# EAGLE design Amplificador_Ganho_1000_Versão4 (EAGLE 4.09)
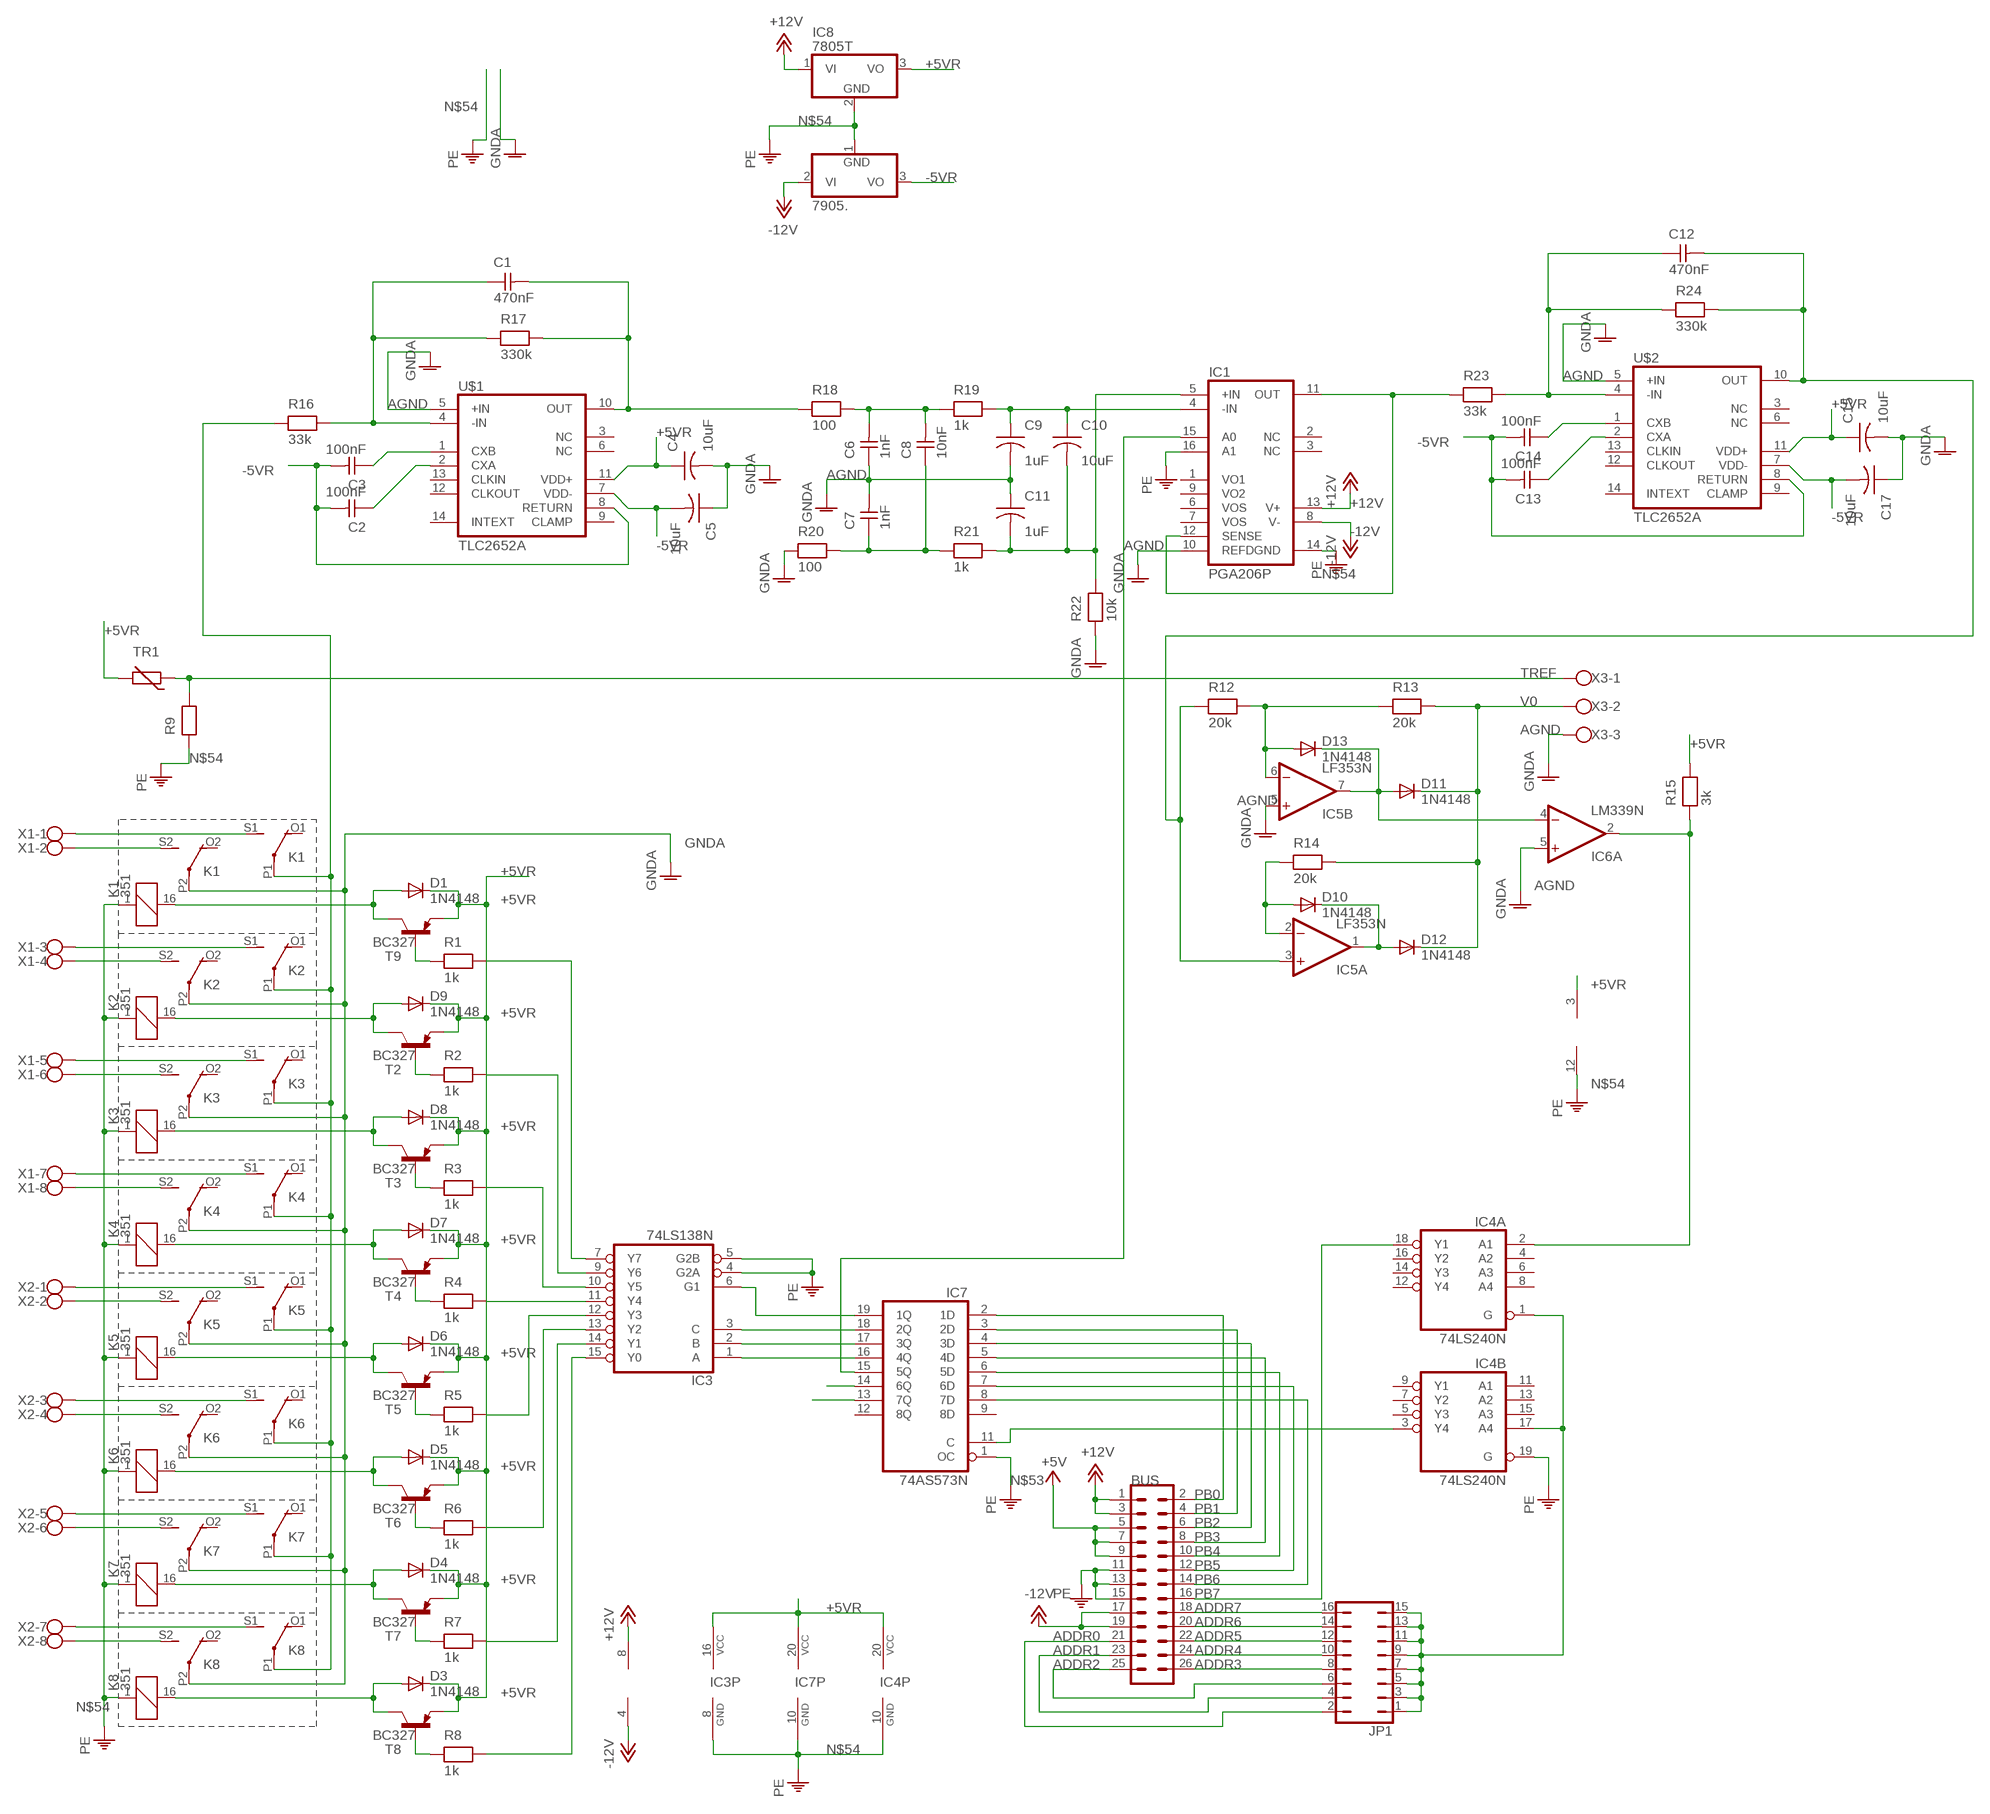
[diagram p0: schematic, sheet 1]

## Parts
7905.  7905T  [TO220H]
BUS  ML26  [ML26]
C1  470nF  CAPNP-5  [C-5]
C2  100nF  CAPNP-5  [C-5]
C3  100nF  CAPNP-5  [C-5]
C4  10uF  CAP-2,5  [C-2,5]
C5  10uF  CAP-2,5  [C-2,5]
C6  1nF  CAPNP-5  [C-5]
C7  1nF  CAPNP-5  [C-5]
C8  10nF  CAPNP-5  [C-5]
C9  1uF  CAP-2,5  [C-2,5]
C10  10uF  CAP-2,5  [C-2,5]
C11  1uF  CAP-2,5  [C-2,5]
C12  470nF  CAPNP-5  [C-5]
C13  100nF  CAPNP-5  [C-5]
C14  100nF  CAPNP-5  [C-5]
C15  10uF  CAP-2,5  [C-2,5]
C17  10uF  CAP-2,5  [C-2,5]
D1  1N4148  [DO35-10]
D3  1N4148  [DO35-10]
D4  1N4148  [DO35-10]
D5  1N4148  [DO35-10]
D6  1N4148  [DO35-10]
D7  1N4148  [DO35-10]
D8  1N4148  [DO35-10]
D9  1N4148  [DO35-10]
D10  1N4148  [DO35-10]
D11  1N4148  [DO35-10]
D12  1N4148  [DO35-10]
D13  1N4148  [DO35-10]
IC1  PGA206P  [DIL16]
IC3  74LS138N  [DIL16]
IC4  74LS240N  [DIL20]
IC5  LF353N  [DIL08]
IC6  LM339N  [DIL14]
IC7  74AS573N  [DIL20]
IC8  7805T  [TO220H]
JP1  JP8Q  [JP8Q]
K1  351  [351]
K2  351  [351]
K3  351  [351]
K4  351  [351]
K5  351  [351]
K6  351  [351]
K7  351  [351]
K8  351  [351]
R1  1k  RESEU-10  [R-10]
R2  1k  RESEU-10  [R-10]
R3  1k  RESEU-10  [R-10]
R4  1k  RESEU-10  [R-10]
R5  1k  RESEU-10  [R-10]
R6  1k  RESEU-10  [R-10]
R7  1k  RESEU-10  [R-10]
R8  1k  RESEU-10  [R-10]
R9  RESEU-10  [R-10]
R12  20k  RESEU-10  [R-10]
R13  20k  RESEU-10  [R-10]
R14  20k  RESEU-10  [R-10]
R15  3k  RESEU-10  [R-10]
R16  33k  RESEU-10  [R-10]
R17  330k  RESEU-10  [R-10]
R18  100  RESEU-10  [R-10]
R19  1k  RESEU-10  [R-10]
R20  100  RESEU-10  [R-10]
R21  1k  RESEU-10  [R-10]
R22  10k  RESEU-10  [R-10]
R23  33k  RESEU-10  [R-10]
R24  330k  RESEU-10  [R-10]
T2  BC327  [TO92]
T3  BC327  [TO92]
T4  BC327  [TO92]
T5  BC327  [TO92]
T6  BC327  [TO92]
T7  BC327  [TO92]
T8  BC327  [TO92]
T9  BC327  [TO92]
TR1  THERM-2,5  [RS-2,5]
U$1  TLC2652A  [DIP14]
U$2  TLC2652A  [DIP14]
X1  AK500/8  [AK500/8]
X2  AK500/8  [AK500/8]
X3  AK500/3  [AK500/3]

## Nets
+5V: BUS.5 BUS.7 BUS.9
+5VR: C4.1 C15.1 D1.C D3.C D4.C D5.C D6.C D7.C D8.C D9.C IC3.16(VCC) IC4.20(P:VCC) IC6.3(P:V+) IC7.20(VCC) IC8.3(VO) R15.2 T2.1(E) T3.1(E) T4.1(E) T5.1(E) T6.1(E) T7.1(E) T8.1(E) T9.1(E) TR1.2 U$1.11(VDD+) U$2.11(VDD+)
+12V: BUS.1 BUS.3 IC1.13(V+) IC5.8(P:V+) IC8.1(VI)
-5VR: 7905..3(VO) C2.2 C3.2 C5.2 C13.2 C14.2 C17.2 U$1.7(VDD-) U$1.8(RETURN) U$2.7(VDD-) U$2.8(RETURN)
-12V: 7905..2(VI) BUS.17 BUS.19 IC1.8(V-) IC5.4(P:V-)
ADDR0: BUS.21 JP1.2
ADDR1: BUS.23 JP1.4
ADDR2: BUS.25 JP1.6
ADDR3: BUS.26 JP1.8
ADDR4: BUS.24 JP1.10
ADDR5: BUS.22 JP1.12
ADDR6: BUS.20 JP1.14
ADDR7: BUS.18 JP1.16
AGND: C4.2 C5.1 C6.1 C7.2 C9.2 C11.1 C15.2 C17.1 IC1.10(REF) IC5.5(B:+IN) IC6.5(A:+IN) R20.1 R22.1 U$1.5(+IN) U$2.5(+IN) X3.3 ; supply symbol labelled GNDA
GNDA: K1.P2(3:P) K2.P2(3:P) K3.P2(3:P) K4.P2(3:P) K5.P2(3:P) K6.P2(3:P) K7.P2(3:P) K8.P2(3:P)
N$1: IC7.14(6Q)
N$2: R5.1 T5.2(B)
N$3: IC3.7(Y7) R1.2
N$4: IC3.9(Y6) R2.2
N$5: IC3.10(Y5) R3.2
N$6: IC3.11(Y4) R4.2
N$7: IC3.15(Y0) R8.2
N$8: IC3.14(Y1) R7.2
N$9: IC3.13(Y2) R6.2
N$10: R1.1 T9.2(B)
N$11: IC3.1(A) IC7.16(4Q)
N$12: IC3.2(B) IC7.17(3Q)
N$13: IC3.3(C) IC7.18(2Q)
N$14: IC3.6(G1) IC7.19(1Q)
N$15: D6.A K5.16 T5.3(C)
N$16: C10.2 C11.2 IC1.5(+IN) R21.2 R22.2
N$17: R2.1 T2.2(B)
N$18: D1.A K1.16 T9.3(C)
N$19: D9.A K2.16 T2.3(C)
N$20: R6.1 T6.2(B)
N$21: R3.1 T3.2(B)
N$22: D8.A K3.16 T3.3(C)
N$23: D5.A K6.16 T6.3(C)
N$24: R4.1 T4.2(B)
N$25: D7.A K4.16 T4.3(C)
N$26: R7.1 T7.2(B)
N$27: D4.A K7.16 T7.3(C)
N$28: R8.1 T8.2(B)
N$29: D3.A K8.16 T8.3(C)
N$30: IC3.12(Y3) R5.2
N$32: IC4.2(A:A1) IC6.2(A:OUT) R15.1
N$33: IC4.1(A:G) IC4.17(B:A4) JP1.1 JP1.3 JP1.5 JP1.7 JP1.9 JP1.11 JP1.13 JP1.15
N$34: IC7.13(7Q)
N$35: K1.S1(2:S) X1.1
N$36: K1.S2(3:S) X1.2
N$37: K2.S1(2:S) X1.3
N$38: K2.S2(3:S) X1.4
N$39: K3.S1(2:S) X1.5
N$40: K3.S2(3:S) X1.6
N$41: K4.S1(2:S) X1.7
N$42: K4.S2(3:S) X1.8
N$43: K5.S1(2:S) X2.1
N$44: K5.S2(3:S) X2.2
N$45: K6.S1(2:S) X2.3
N$46: K6.S2(3:S) X2.4
N$47: K7.S1(2:S) X2.5
N$48: K7.S2(3:S) X2.6
N$49: K8.S1(2:S) X2.7
N$50: K8.S2(3:S) X2.8
N$52: IC1.11(OUT) IC1.12(SENSE) R23.1
N$53: IC4.3(B:Y4) IC7.11(C)
N$54: 7905..1(GND) BUS.11 BUS.13 BUS.15 IC1.14(DGND) IC1.16(A1) IC3.4(G2A) IC3.5(G2B) IC3.8(GND) IC4.10(P:GND) IC4.19(B:G) IC6.12(P:V-) IC7.1(OC) IC7.10(GND) IC8.2(GND) K1.1 K2.1 K3.1 K4.1 K5.1 K6.1 K7.1 K8.1 R9.1 ; supply symbol labelled PE
N$56: D10.A IC5.2(A:-IN) R14.1
N$57: C1.2 R17.2 R18.1 U$1.10(OUT)
N$58: D10.C D12.A IC5.1(A:OUT)
N$59: K1.P1(2:P) K2.P1(2:P) K3.P1(2:P) K4.P1(2:P) K5.P1(2:P) K6.P1(2:P) K7.P1(2:P) K8.P1(2:P) R16.1
N$60: C3.1 U$1.1(CXB)
N$62: C2.1 U$1.2(CXA)
N$63: D13.A IC5.6(B:-IN) R12.2 R13.1
N$64: D11.A D13.C IC5.7(B:OUT) IC6.4(A:-IN)
N$65: C6.2 C8.2 R18.2 R19.1
N$66: C12.2 IC5.3(A:+IN) R12.1 R24.2 U$2.10(OUT)
N$67: C1.1 R16.2 R17.1 U$1.4(-IN)
N$68: IC1.15(A0) IC7.15(5Q)
N$69: C7.1 C8.1 R20.2 R21.1
N$70: C14.1 U$2.1(CXB)
N$71: C9.1 C10.1 IC1.4(-IN) R19.2
N$73: C13.1 U$2.2(CXA)
N$74: C12.1 R23.2 R24.1 U$2.4(-IN)
PB0: BUS.2 IC7.2(1D)
PB1: BUS.4 IC7.3(2D)
PB2: BUS.6 IC7.4(3D)
PB3: BUS.8 IC7.5(4D)
PB4: BUS.10 IC7.6(5D)
PB5: BUS.12 IC7.7(6D)
PB6: BUS.14 IC7.8(7D)
PB7: BUS.16 IC4.18(A:Y1)
TREF: R9.2 TR1.1 X3.1
V0: D11.C D12.C R13.2 R14.2 X3.2
Unconnected: IC1.1(VO1) IC1.2(NC) IC1.3(NC) IC1.6(VOS) IC1.7(VOS) IC1.9(VO2) IC4.4(A:A2) IC4.5(B:Y3) IC4.6(A:A3) IC4.7(B:Y2) IC4.8(A:A4) IC4.9(B:Y1) IC4.11(B:A1) IC4.12(A:Y4) IC4.13(B:A2) IC4.14(A:Y3) IC4.15(B:A3) IC4.16(A:Y2) IC6.1(B:OUT) IC6.6(B:-IN) IC6.7(B:+IN) IC6.8(C:-IN) IC6.9(C:+IN) IC6.10(D:-IN) IC6.11(D:+IN) IC6.13(D:OUT) IC6.14(C:OUT) IC7.9(8D) IC7.12(8Q) K1.O1(2:O) K1.O2(3:O) K2.O1(2:O) K2.O2(3:O) K3.O1(2:O) K3.O2(3:O) K4.O1(2:O) K4.O2(3:O) K5.O1(2:O) K5.O2(3:O) K6.O1(2:O) K6.O2(3:O) K7.O1(2:O) K7.O2(3:O) K8.O1(2:O) K8.O2(3:O) U$1.3(NC) U$1.6(NC) U$1.9(CLAMP) U$1.12(CLKOUT) U$1.13(CLKIN) U$1.14(INTEXT) U$2.3(NC) U$2.6(NC) U$2.9(CLAMP) U$2.12(CLKOUT) U$2.13(CLKIN) U$2.14(INTEXT)

## Library data of the parts
7905. = linear:79*: Negative VOLTAGE REGULATOR
BUS = con-harting-ml:ML26: HARTING
C1-C3 C6-C8 C12-C14 = discrete:CAPNP-5
C4 C5 C9-C11 C15 C17 = discrete:CAP-2,5
D1 D3-D13 = diode:1N4148: DIODE high speed (Philips)
IC1 = burr-brown:PGA206: High-Speed Programmable Gain Instrumentation Amplifier
IC3 = 74xx-us:74*138: 3-line to 8-line DECODER/DEMULTIPLEXER
IC4 = 74xx-us:74*240: Octal BUFFER and LINE DRIVER, 3-state
IC5 = linear:LF353: OP AMP
IC6 = linear:LM339: COMPARATOR
IC7 = 74xx-us:74*573: 8-bit D latch BUS DRIVER
IC8 = linear:78*: Positive VOLTAGE REGULATOR
JP1 = jumper:JP8Q: JUMPER
K1-K8 = relay:351: RELAY 2 x switch, Omron
R1-R9 R12-R24 = discrete:RESEU-10
T2-T9 = transistor-pnp:BC327: PNP Transistor
TR1 = discrete:THERM-2,5
U$1 U$2 = ti:TLC2652A
X1 X2 = con-ptr500:AK500/8: CONNECTOR
X3 = con-ptr500:AK500/3: CONNECTOR

## Board
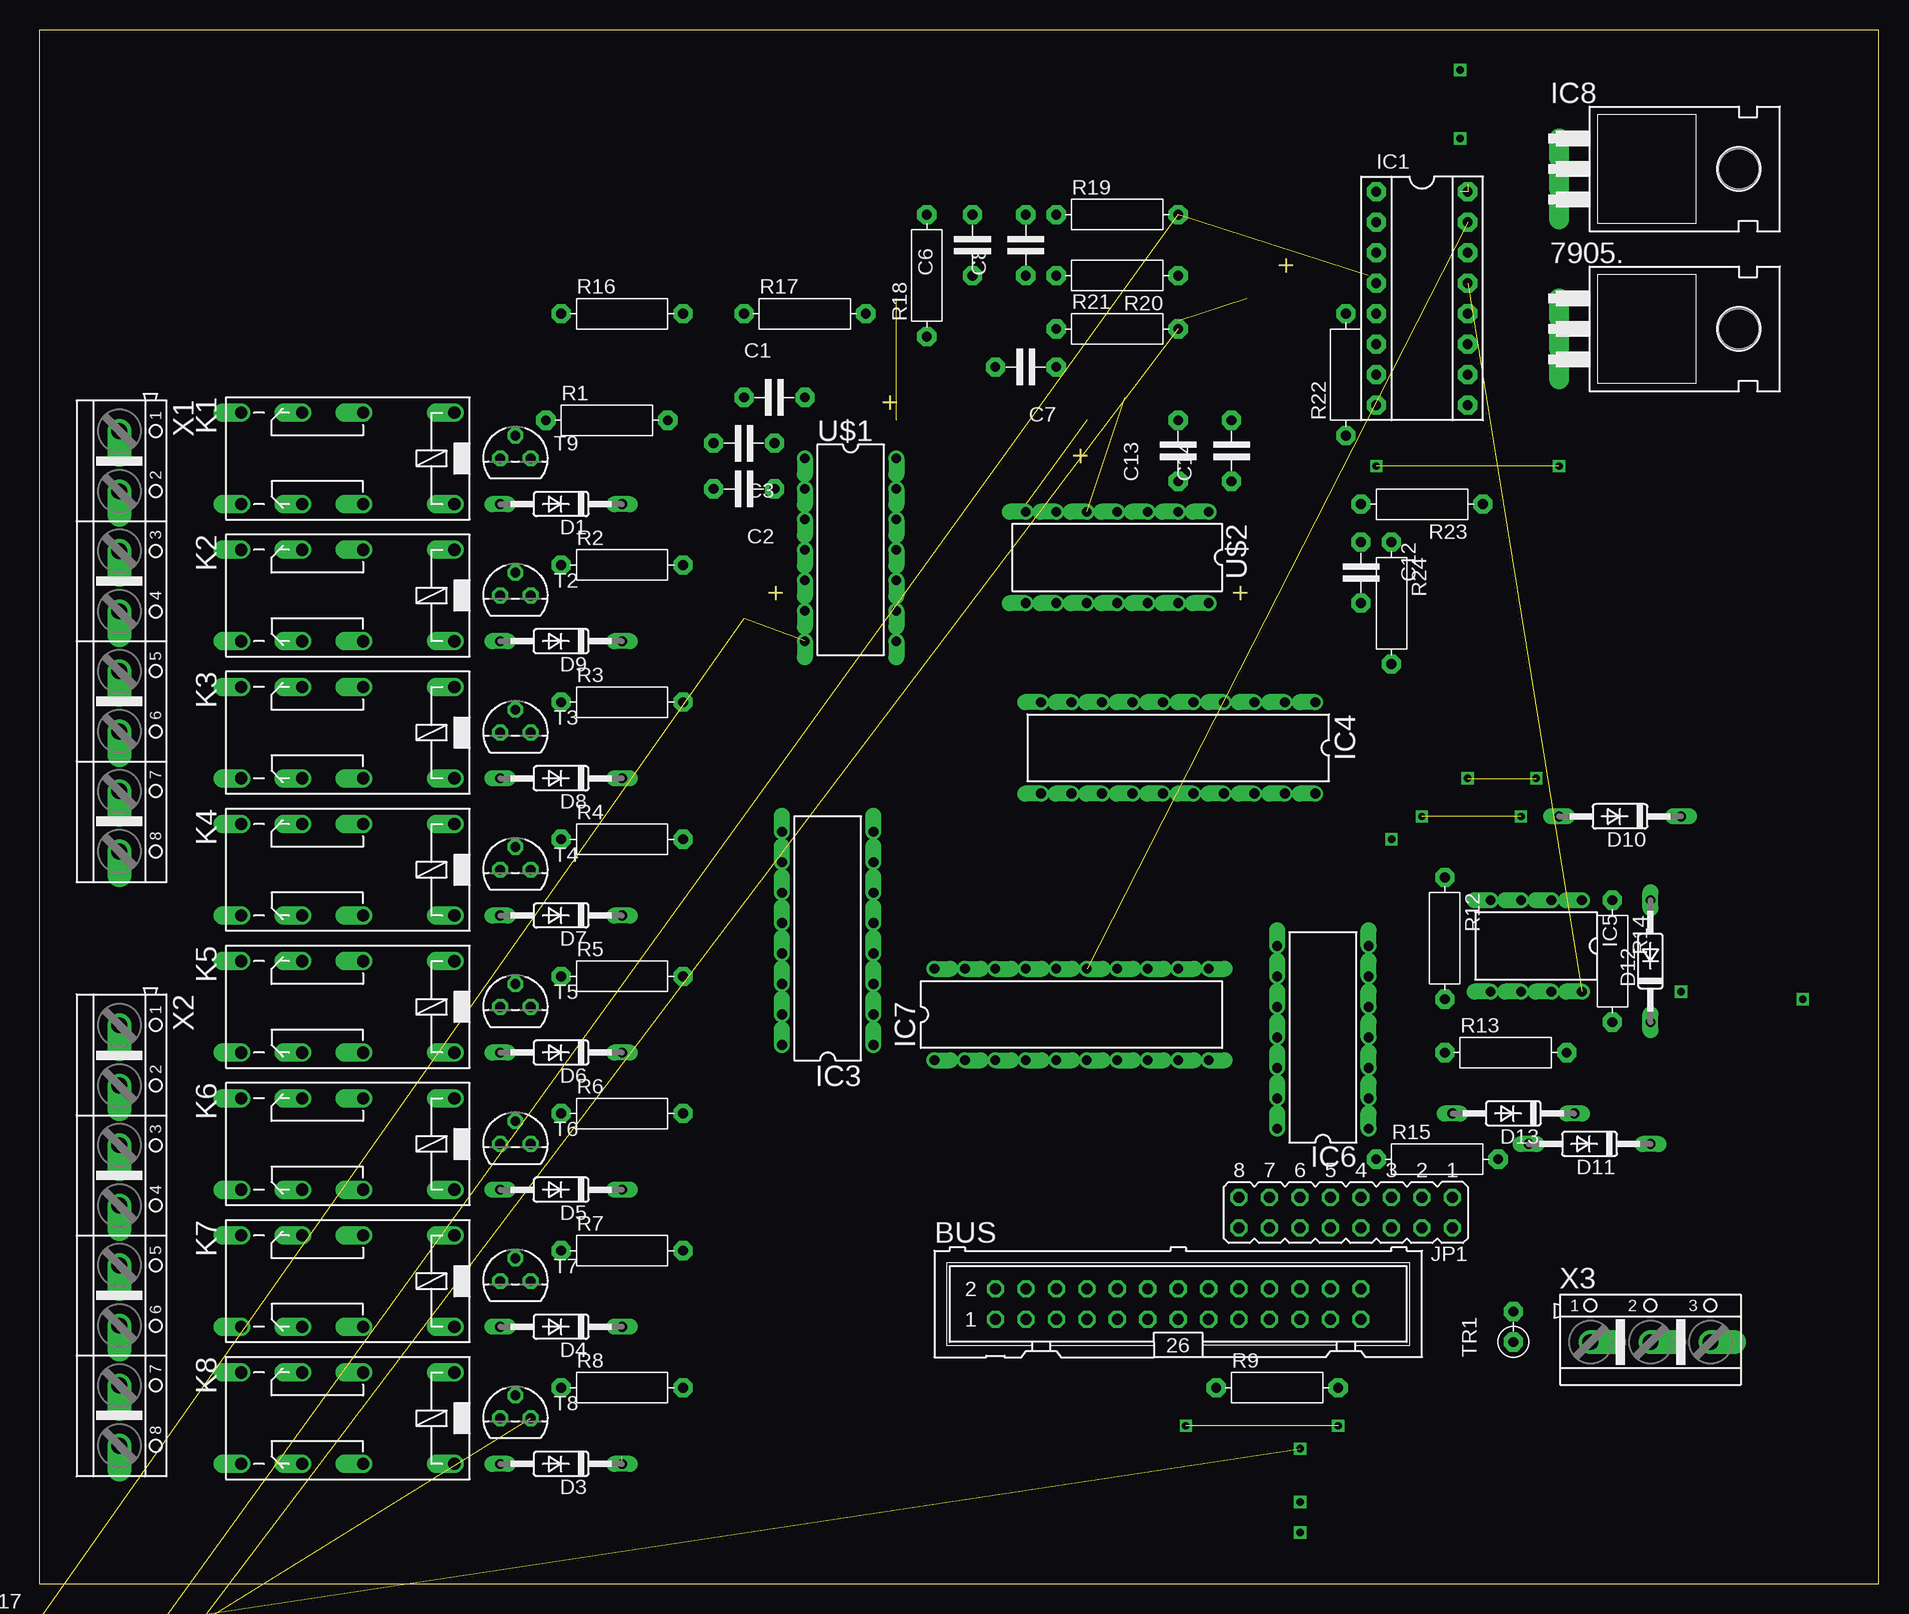
[diagram p1: board, top side]
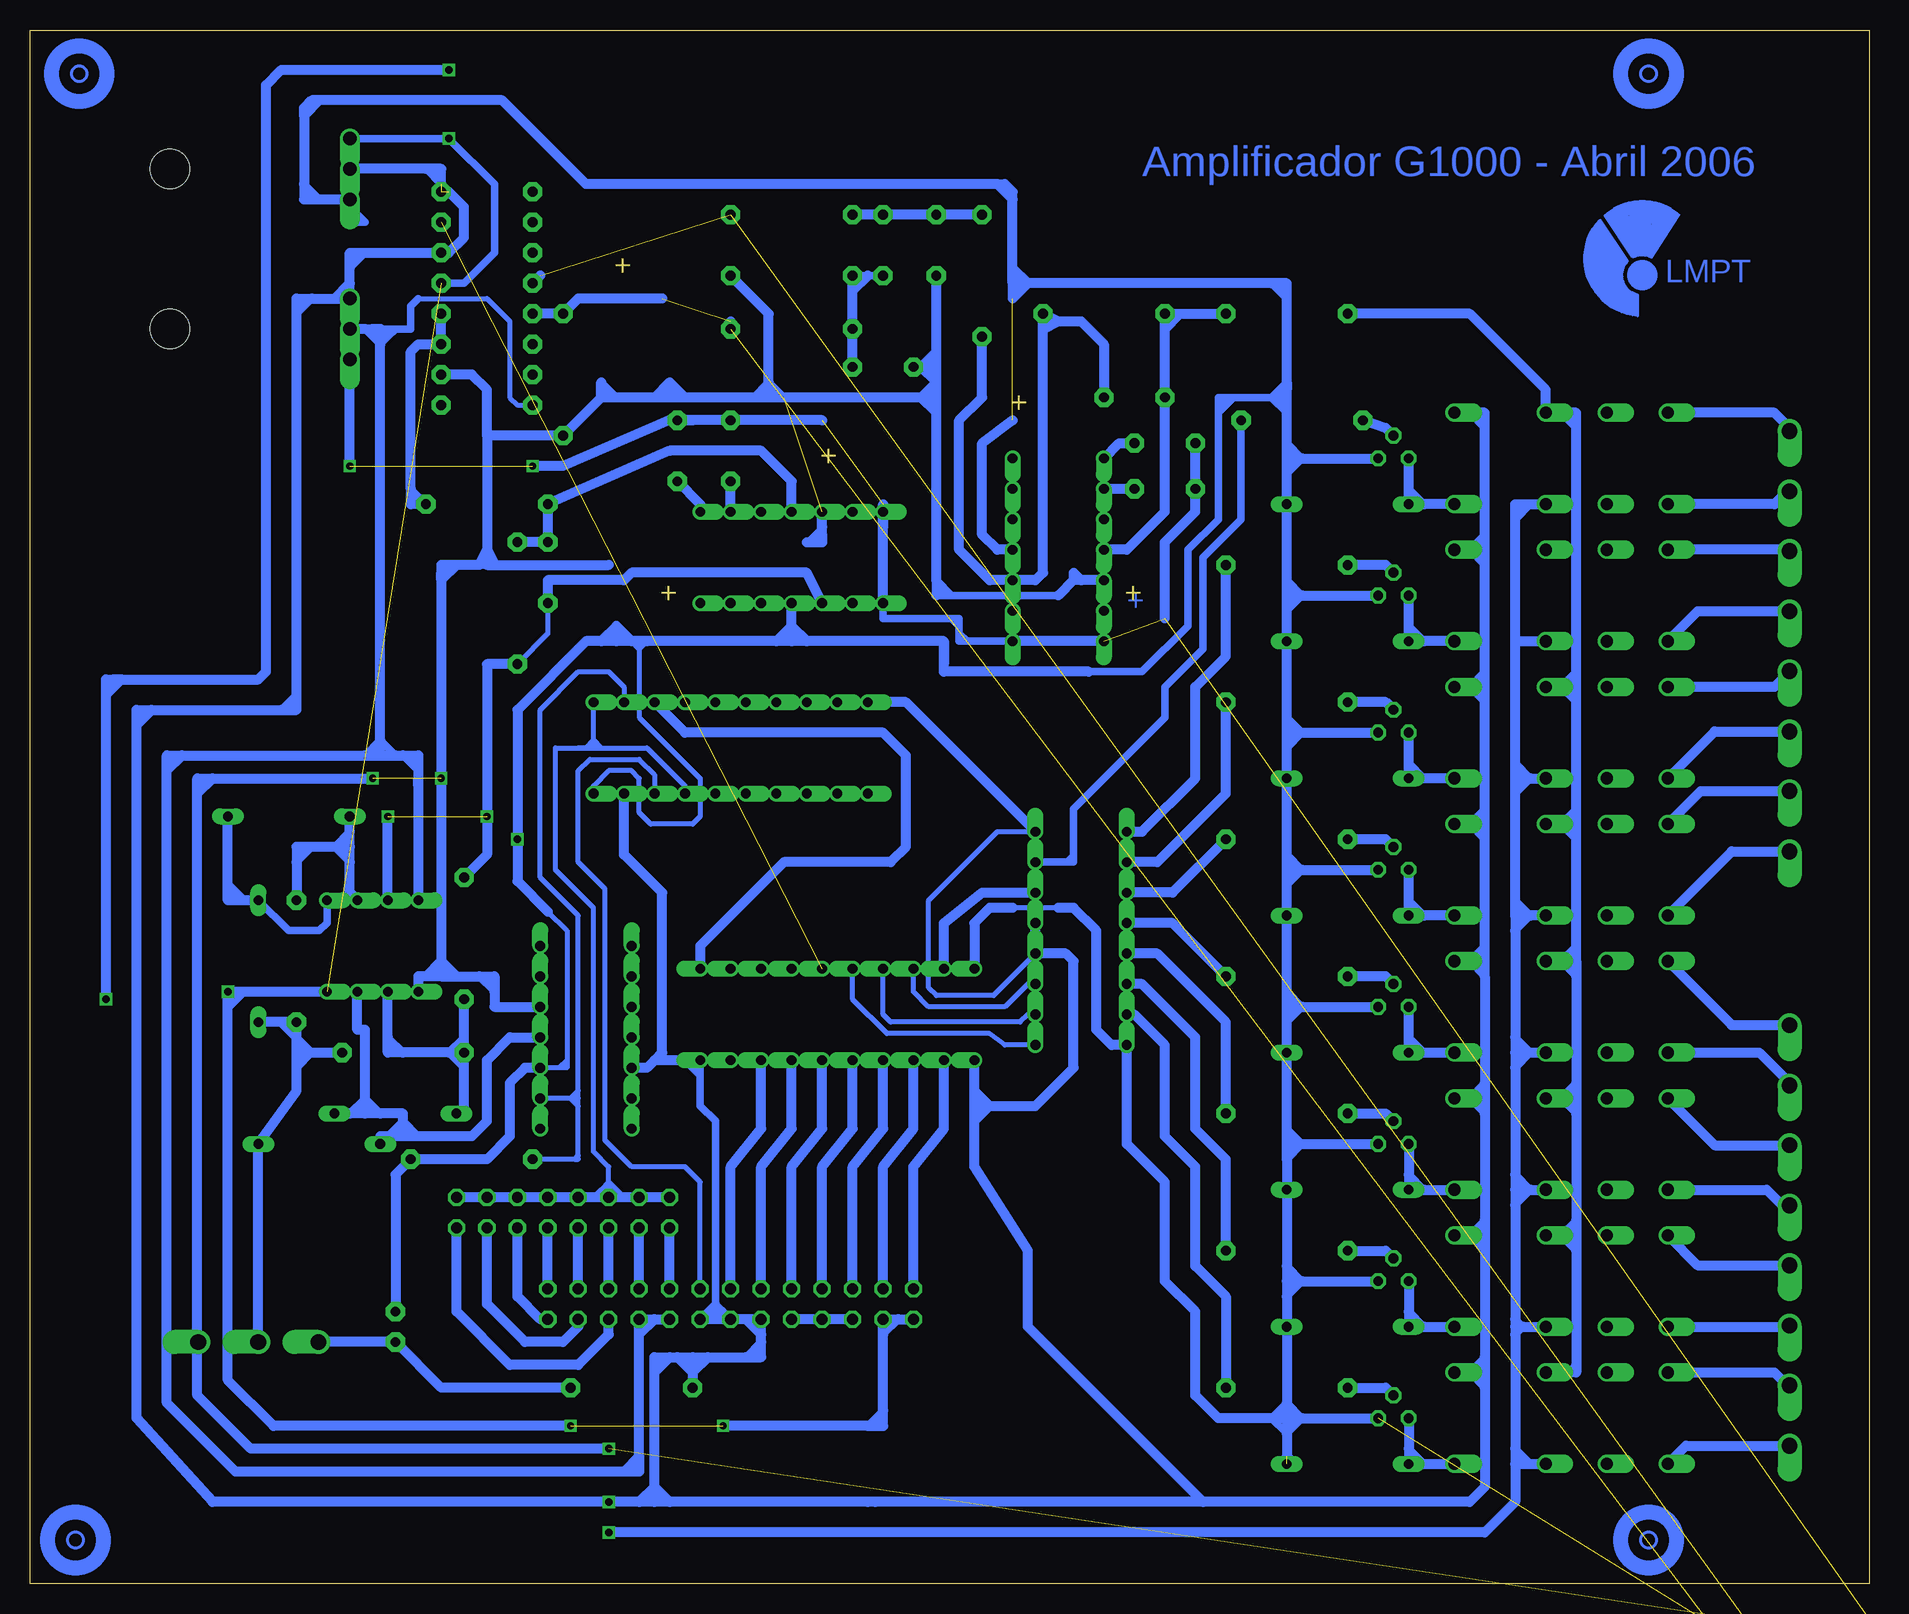
[diagram p2: board, bottom side, seen from below]

Size 153.33 x 129.53 mm. Coordinates in mm from the lower left corner, seen from the top.
Outline: 0,0 153.33,0 153.33,129.53 0,129.53 0,0
Copper layers used: Bottom

### Footprints (pad centres in the part's own frame; a part is rotated, then mirrored left to right if it is on the bottom)
TO220H = drill 1.118 offset: 1 -2.54,-10.16; 2 0,-10.16; 3 2.54,-10.16 | hole 3.302: 0,4.826
ML26 = drill 0.914 octagon: 1 -15.24,-1.27; 2 -15.24,1.27; 3 -12.7,-1.27; 4 -12.7,1.27; 5 -10.16,-1.27; 6 -10.16,1.27; 7 -7.62,-1.27; 8 -7.62,1.27; 9 -5.08,-1.27; 10 -5.08,1.27; 11 -2.54,-1.27; 12 -2.54,1.27; 13 0,-1.27; 14 0,1.27; 15 2.54,-1.27; 16 2.54,1.27; 17 5.08,-1.27; 18 5.08,1.27; 19 7.62,-1.27; 20 7.62,1.27; 21 10.16,-1.27; 22 10.16,1.27; 23 12.7,-1.27; 24 12.7,1.27; 25 15.24,-1.27; 26 15.24,1.27
C-5 = drill 0.813 pad 1.6 octagon: 1 -2.54,0; 2 2.54,0
C-2,5 = drill 0.813 pad 1.6 octagon: 1 -1.27,0; 2 1.27,0
DO35-10 = drill 0.813 long: A 5.08,0; C -5.08,0
DIL16 = drill 0.813 pad 1.6 octagon: 1 -8.89,-3.81; 2 -6.35,-3.81; 3 -3.81,-3.81; 4 -1.27,-3.81; 5 1.27,-3.81; 6 3.81,-3.81; 7 6.35,-3.81; 8 8.89,-3.81; 9 8.89,3.81; 10 6.35,3.81; 11 3.81,3.81; 12 1.27,3.81; 13 -1.27,3.81; 14 -3.81,3.81; 15 -6.35,3.81; 16 -8.89,3.81
DIL16' = drill 0.813 offset: 1 -8.89,-3.81; 2 -6.35,-3.81; 3 -3.81,-3.81; 4 -1.27,-3.81; 5 1.27,-3.81; 6 3.81,-3.81; 7 6.35,-3.81; 8 8.89,-3.81; 9 8.89,3.81; 10 6.35,3.81; 11 3.81,3.81; 12 1.27,3.81; 13 -1.27,3.81; 14 -3.81,3.81; 15 -6.35,3.81; 16 -8.89,3.81
DIL20 = drill 0.813 offset: 1 -11.43,-3.81; 2 -8.89,-3.81; 3 -6.35,-3.81; 4 -3.81,-3.81; 5 -1.27,-3.81; 6 1.27,-3.81; 7 3.81,-3.81; 8 6.35,-3.81; 9 8.89,-3.81; 10 11.43,-3.81; 11 11.43,3.81; 12 8.89,3.81; 13 6.35,3.81; 14 3.81,3.81; 15 1.27,3.81; 16 -1.27,3.81; 17 -3.81,3.81; 18 -6.35,3.81; 19 -8.89,3.81; 20 -11.43,3.81
DIL08 = drill 0.813 offset: 1 -3.81,-3.81; 2 -1.27,-3.81; 3 1.27,-3.81; 4 3.81,-3.81; 5 3.81,3.81; 6 1.27,3.81; 7 -1.27,3.81; 8 -3.81,3.81
DIL14 = drill 0.813 offset: 1 -7.62,-3.81; 2 -5.08,-3.81; 3 -2.54,-3.81; 4 0,-3.81; 5 2.54,-3.81; 6 5.08,-3.81; 7 7.62,-3.81; 8 7.62,3.81; 9 5.08,3.81; 10 2.54,3.81; 11 0,3.81; 12 -2.54,3.81; 13 -5.08,3.81; 14 -7.62,3.81
JP8Q = drill 0.914 octagon: 1 -8.89,-1.27; 2 -8.89,1.27; 3 -6.35,-1.27; 4 -6.35,1.27; 5 -3.81,-1.27; 6 -3.81,1.27; 7 -1.27,-1.27; 8 -1.27,1.27; 9 1.27,-1.27; 10 1.27,1.27; 11 3.81,-1.27; 12 3.81,1.27; 13 6.35,-1.27; 14 6.35,1.27; 15 8.89,-1.27; 16 8.89,1.27
351 = drill 1.016 offset: 1 -3.81,-3.81; 16 -3.81,3.81; O1 8.89,-3.81; O2 8.89,3.81; P1 3.81,-3.81; P2 3.81,3.81; S1 13.97,-3.81; S2 13.97,3.81
R-10 = drill 0.813 pad 1.6 octagon: 1 -5.08,0; 2 5.08,0
TO92 = drill 0.813 octagon: 1 1.27,0; 2 0,1.905; 3 -1.27,0
RS-2,5 = drill 0.813 pad 1.6 octagon: 1 0,0; 2 2.54,0
DIP14 = drill 0.813 offset: 1 -7.62,-3.81; 2 -5.08,-3.81; 3 -2.54,-3.81; 4 0,-3.81; 5 2.54,-3.81; 6 5.08,-3.81; 7 7.62,-3.81; 8 7.62,3.81; 9 5.08,3.81; 10 2.54,3.81; 11 0,3.81; 12 -2.54,3.81; 13 -5.08,3.81; 14 -7.62,3.81
AK500/8 = drill 1.321 offset: 1 -17.526,0; 2 -12.497,0; 3 -7.518,0; 4 -2.489,0; 5 2.489,0; 6 7.518,0; 7 12.497,0; 8 17.526,0
AK500/3 = drill 1.321 offset: 1 -5.004,0; 2 0,0; 3 5.004,0

### Placement (x,y rotation side)
7905.  136.84,104.61 270 top
BUS  94.93,23.33 0 top
C1  61.27,98.9 0 top
C2  58.73,91.28 180 top
C3  58.73,95.09 180 top
C4  -2.86,-49.69 0 top  (outside the outline)
C5  -2.86,-58.58 0 top  (outside the outline)
C6  77.78,111.59 90 top
C7  82.23,101.44 180 top
C8  82.23,111.59 90 top
C9  -2.86,-31.91 0 top  (outside the outline)
C10  -2.86,-23.02 0 top  (outside the outline)
C11  -2.86,-40.8 0 top  (outside the outline)
C12  110.17,84.29 270 top
C13  94.93,94.45 90 top
C14  99.37,94.45 90 top
C15  -2.86,-14.14 0 top  (outside the outline)
C17  -2.86,-5.24 0 top  (outside the outline)
D1  43.49,90.01 180 top
D3  43.49,10 180 top
D4  43.49,21.43 180 top
D5  43.49,32.86 180 top
D6  43.49,44.28 180 top
D7  43.49,55.72 180 top
D8  43.49,67.14 180 top
D9  43.49,78.58 180 top
D10  131.76,63.97 180 top
D11  129.22,36.67 180 top
D12  134.3,51.91 90 top
D13  122.87,39.2 180 top
IC1  115.25,107.15 270 top
IC3  74LS138N  [DIL16']  65.72,53.81 90 top
IC4  94.93,69.69 180 top
IC5  124.77,53.17 180 top
IC6  106.99,45.56 90 top
IC7  86.04,47.46 0 top
IC8  136.84,117.95 270 top
JP1  108.9,30.95 180 top
K1  30.79,93.82 180 top
K2  30.79,82.39 180 top
K3  30.79,70.95 180 top
K4  30.79,59.53 180 top
K5  30.79,48.09 180 top
K6  30.79,36.67 180 top
K7  30.79,25.23 180 top
K8  30.79,13.81 180 top
R1  47.3,96.99 0 top
R2  48.57,84.93 0 top
R3  48.57,73.5 0 top
R4  48.57,62.06 0 top
R5  48.57,50.64 0 top
R6  48.57,39.2 0 top
R7  48.57,27.78 0 top
R8  48.57,16.35 0 top
R9  103.18,16.35 0 top
R12  117.15,53.81 270 top
R13  122.23,44.28 0 top
R14  131.12,51.91 270 top
R15  116.52,35.4 0 top
R16  48.57,105.88 0 top
R17  63.81,105.88 0 top
R18  73.97,109.06 90 top
R19  89.85,114.14 0 top
R20  89.85,109.06 180 top
R21  89.85,104.61 0 top
R22  108.9,100.8 90 top
R23  115.25,90.01 180 top
R24  112.71,81.75 270 top
T2  39.68,82.39 0 top
T3  39.68,70.95 0 top
T4  39.68,59.53 0 top
T5  39.68,48.09 0 top
T6  39.68,36.67 0 top
T7  39.68,25.23 0 top
T8  39.68,13.81 0 top
T9  39.68,93.82 0 top
TR1  122.87,20.16 90 top
U$1  67.62,86.2 270 top
U$2  89.85,85.56 180 top
X1  6.66,78.58 270 top
X2  6.66,29.05 270 top
X3  134.3,20.16 0 top

### Tracks (layer width: path | path; a pad name or v marks a point on that pad's centre or on a via)
+5V
  Bottom 0.813: BUS.5 BUS.7 BUS.9
+5VR  (via drill 0.61)  (4 unrouted)
  Bottom 0.406: 109.21,43.02 108.58,43.02 108.58,43.65 | 109.21,43.02 IC6.3 | 108.58,43.65 108.58,54.45 110.17,56.03 | 108.58,43.65 109.21,43.02 | 67.62,56.35 71.43,56.35 | IC4.20 106.36,66.51 105.09,67.78 103.18,67.78 102.55,67.14 102.55,64.29 101.6,63.34 98.1,63.34 97.47,63.97 97.47,67.14 102.55,72.23 102.55,77.94 | 102.55,77.94 103.18,78.58 | 101.91,78.58 102.55,77.94 | 102.55,78.58 102.55,77.94
  Bottom 0.61: 125.41,113.5 126.68,113.5 126.68,114.14 | IC8.3 126.68,114.77 | 126.68,114.77 126.68,114.14 | 49.21,98.9 48.57,98.9 | 49.84,98.9 53.02,98.9 | 53.02,98.9 53.65,98.9 | 53.65,98.9 54.29,98.9 54.29,97.62 | 54.29,97.62 54.29,88.73 56.83,86.2 56.83,79.84 60.64,76.03 65.08,76.03 | 48.57,35.4 47.3,36.67 48.57,37.94 | 48.57,49.37 47.3,48.09 48.57,46.83 | 48.57,60.8 47.3,59.53 48.57,58.25 | 48.57,72.23 47.3,70.95 48.57,69.69 | 48.57,107.15 49.84,108.42 | 49.84,98.9 48.57,100.17 | 49.84,98.9 49.21,98.9 | 49.21,98.9 48.57,99.53 | 48.57,97.62 49.84,98.9 | 48.57,98.26 49.21,98.9 | 48.57,83.66 47.3,82.39 48.57,81.11 | 48.57,26.51 47.3,25.23 48.57,23.97 | 48.57,95.09 47.3,93.82 48.57,92.55 | 126.68,114.77 125.41,113.5 | 125.41,113.5 126.04,113.5 126.68,114.14 | 130.49,116.68 129.22,115.41 | 53.02,98.9 54.29,97.62 | 54.29,97.62 54.29,98.26 53.65,98.9 | 48.57,15.08 47.3,13.81 48.57,12.54 49.84,13.81 48.57,15.08
  Bottom 0.813: 104.45,78.58 104.45,79.84 | 89.85,78.58 91.12,78.58 | 91.12,78.58 101.91,78.58 102.55,78.58 103.18,78.58 | 103.18,78.58 104.45,78.58 | 89.85,78.58 89.85,79.84 | 89.85,79.84 U$2.11 | 71.43,96.99 73.97,95.09 73.97,87.47 72.7,86.2 U$1.11 | 71.43,108.42 71.43,107.15 70.16,108.42 | 48.57,13.81 48.57,12.54 48.57,10.63 47.94,10 | 48.57,13.81 47.3,13.81 T8.1 | 48.57,25.23 48.57,23.97 D4.C 48.57,15.08 48.57,13.81 | 48.57,25.23 47.3,25.23 T7.1 | 48.57,36.67 48.57,35.4 D5.C 48.57,26.51 48.57,25.23 | 48.57,36.67 47.3,36.67 T6.1 | 48.57,48.09 48.57,46.83 D6.C 48.57,37.94 48.57,36.67 | 48.57,48.09 47.3,48.09 T5.1 | 48.57,59.53 48.57,58.25 D7.C 48.57,49.37 48.57,48.09 | 48.57,59.53 47.3,59.53 T4.1 | 48.57,70.95 48.57,69.69 D8.C 48.57,60.8 48.57,59.53 | 48.57,70.95 47.3,70.95 T3.1 | 48.57,82.39 48.57,81.11 D9.C 48.57,72.23 48.57,70.95 | 48.57,82.39 47.3,82.39 T2.1 | 48.57,93.82 48.57,92.55 D1.C 48.57,83.66 48.57,82.39 | 48.57,93.82 47.3,93.82 T9.1 | 48.57,93.82 48.57,95.09 48.57,97.62 48.57,98.26 48.57,98.9 48.57,99.53 48.57,100.17 48.57,107.15 48.57,108.42 49.84,108.42 70.16,108.42 | 70.16,108.42 71.43,108.42 | 48.57,13.81 49.84,13.81 54.29,13.81 56.19,15.71 56.19,22.7 58.73,25.23 58.73,33.49 61.91,36.67 IC3.16 63.18,44.92 64.45,46.19 64.45,54.45 66.35,56.35 67.62,56.35 | IC6.3 112.07,43.02 113.34,41.75 113.34,37.3 115.25,35.4 R15.2 122.87,34.12 TR1.2 | 77.15,78.58 88.58,78.58 | 88.58,78.58 89.85,78.58 | 71.43,108.42 71.43,109.69 | 71.43,109.69 71.43,115.41 | 71.43,115.41 71.43,116.04 72.07,116.68 72.7,116.68 | 72.7,116.68 106.99,116.68 113.98,123.66 129.22,123.66 | 129.22,123.66 129.85,123.66 130.49,123.03 130.49,122.39
  Bottom 0.813: 130.49,122.39 130.49,116.68 130.49,115.41 129.22,115.41 IC8.3 | 77.15,78.58 77.15,76.03 65.08,76.03 | 129.22,123.66 130.49,122.39 | 103.18,78.58 104.45,79.84 | 71.43,115.41 72.7,116.68 | 70.16,108.42 71.43,109.69 | 105.72,78.58 106.99,78.58 112.71,72.86 v112.71,62.06 112.71,58.57 110.17,56.03 | 104.45,78.58 105.72,78.58 | 104.45,79.84 105.72,78.58 | 88.58,78.58 89.85,79.84 | 89.85,79.84 91.12,78.58 | IC7.20 74.61,55.08 73.34,56.35 71.43,56.35 | 77.15,78.58 77.15,76.67
+12V  (via drill 0.61)  (2 unrouted)
  Bottom 0.61: 83.5,13.17 82.23,14.44 | 82.23,20.79 80.96,22.06 | IC1.13 117.15,108.42 114.61,110.96 114.61,116.68 v118.42,120.48 IC8.1
  Bottom 0.813: BUS.1 80.96,22.06 BUS.3 82.23,20.79 82.23,14.44 82.23,13.17 83.5,13.17 v95.56,13.17 | 135.57,49.37 v136.84,49.37 136.84,48.09 | 135.57,49.37 IC5.8 | 136.84,48.09 136.84,16.98 133.03,13.17 v108.26,13.17 | 136.84,48.09 135.57,49.37
-5VR  (via drill 0.61)  (5 unrouted)
  Bottom 0.61: U$1.8 75.24,78.58 | 75.24,78.58 75.88,78.58 75.88,79.21 | 75.88,79.21 75.88,79.84 | 75.88,79.84 75.88,80.48 76.51,80.48 | 76.51,80.48 82.23,80.48 U$2.8 | 75.24,78.58 75.88,79.21 | 75.88,79.84 76.51,80.48
  Bottom 0.813: C14.2 98.1,96.99 | C14.2 100.01,96.99 108.9,93.18 v111.44,93.18 | C3.2 C2.2 56.19,89.37 58.73,86.83 58.73,80.48 | U$1.7 U$1.8 | C14.2 C13.2 87.31,96.99 | 82.23,90.01 U$2.7 | 82.23,90.01 82.23,88.1 | U$2.8 82.23,90.01 | v126.68,93.18 7905..3
-12V
  Bottom 0.406: 124.14,104.61 122.87,104.61 | IC1.8 112.71,98.26 113.34,98.9 113.34,105.25 115.25,107.15 120.96,107.15
  Bottom 0.61: 122.87,104.61 121.6,104.61 121.6,105.25 121.6,106.52 120.96,107.15 | 125.41,104.61 124.14,103.34 123.5,103.98 | 123.5,103.98 122.87,104.61 | 122.87,104.61 124.77,104.61 | 124.14,104.61 123.5,103.98 | 122.87,69.05 124.14,70.32 125.41,69.05 | 122.23,69.05 120.96,67.78
  Bottom 0.813: 101.28,22.06 BUS.19 102.55,20.79 | 101.28,22.06 BUS.17 | 102.55,10.63 102.55,9.36 103.82,9.36 | 102.55,10.63 102.55,20.79 | 103.82,9.36 136.2,9.36 141.92,15.08 141.92,67.78 | 7905..2 125.41,104.61 124.77,104.61 124.14,104.61 124.14,103.34 124.14,70.32 124.14,69.05 | 120.96,66.51 IC5.4 | 120.96,66.51 120.96,67.14 | 141.92,67.78 141.92,69.05 140.65,69.05 | 120.96,66.51 120.96,67.78 120.96,69.05 122.23,69.05 122.87,69.05 124.14,69.05 | 140.65,69.05 125.41,69.05 124.14,69.05 | 102.55,10.63 103.82,9.36 | 102.55,20.79 101.28,22.06 | 141.92,67.78 140.65,69.05
ADDR0
  Bottom 0.813: JP1.2 117.79,22.7 113.34,18.25 107.63,18.25 105.09,20.79 BUS.21
ADDR1
  Bottom 0.813: BUS.23 107.63,21.43 108.9,20.16 112.07,20.16 115.25,23.33 JP1.4
ADDR2
  Bottom 0.813: BUS.25 110.8,22.06 112.71,23.97 JP1.6
ADDR3
  Bottom 0.813: BUS.26 JP1.8
ADDR4
  Bottom 0.813: BUS.24 JP1.10
ADDR5
  Bottom 0.813: BUS.22 JP1.12
ADDR6
  Bottom 0.813: BUS.20 JP1.14
ADDR7
  Bottom 0.813: BUS.18 JP1.16
AGND  (via drill 0.61)  (8 unrouted)
  Bottom 0.406: 77.78,82.39 77.78,83.02 | 87.31,88.1 88.58,86.83 87.94,86.83 87.31,87.47
  Bottom 0.61: 77.15,82.39 77.78,82.39 | 76.51,82.39 77.15,82.39 | 67.62,82.39 76.51,82.39 | 115.25,84.93 115.88,84.93 | 76.51,82.39 77.78,83.66 77.78,83.02 77.15,82.39 | 90.48,98.9 91.75,100.17 93.02,98.9 | 104.45,98.9 105.72,100.17 | 115.88,50.64 114.61,49.37 | 117.79,84.93 118.42,84.93
  Bottom 0.813: IC1.10 116.52,100.8 115.25,99.53 115.25,95.72 | U$2.5 87.31,88.1 87.31,87.47 87.31,86.83 88.58,86.83 | U$1.5 65.72,83.66 | 65.72,83.66 66.35,84.29 66.35,83.66 | 77.78,101.44 77.78,102.7 | 77.78,102.7 C6.1 | 66.35,83.66 67.62,82.39 | 65.72,83.66 66.35,83.66 | 77.78,98.9 77.78,100.17 | 77.78,100.17 77.78,101.44 | 77.78,101.44 79.05,101.44 | 79.05,101.44 C7.2 | 91.75,98.9 90.48,98.9 79.05,98.9 | 77.78,98.9 79.05,98.9 | 105.72,98.9 104.45,98.9 101.28,98.9 | 98.74,98.9 93.02,98.9 91.75,98.9 | 98.74,98.9 100.01,98.9 | 100.01,98.9 101.28,98.9 | 105.72,98.9 105.72,100.17 | R20.1 91.75,105.88 91.75,100.17 91.75,98.9 | 115.25,95.72 R22.1 105.72,98.9 | IC5.5 120.96,50.64 120.33,50.64 | 138.11,67.14 139.38,67.14 139.38,65.88 | 138.11,67.14 v124.77,67.14 | 114.61,84.93 115.25,84.93 115.25,86.2 | 114.61,84.93 105.09,84.93 | 115.25,95.72 115.25,86.2 | 139.38,20.16 X3.3 | 139.38,20.16 139.38,65.88 | 139.38,20.16 139.38,15.71 134.93,11.27 v105.09,11.27 | 119.06,50.64 120.33,50.64 | 119.06,50.64 117.79,50.64 | 117.79,50.64 115.88,50.64 114.61,50.64 114.61,49.37 114.61,48.09 IC6.5 | 77.78,97.62 77.78,83.66 77.78,82.39 | 77.78,97.62 77.78,98.9 | 117.79,84.93 119.06,84.93 119.06,84.29 | 117.79,84.93 115.88,84.93 115.25,86.2 | 119.06,83.66 119.06,84.29 | 119.06,83.66 v119.06,67.14 119.06,51.91 | 139.38,65.88 138.11,67.14 | 118.42,84.93 119.06,84.29 | 115.25,86.2 114.61,84.93 | 119.06,51.91 119.06,50.64 | 119.06,51.91 117.79,50.64 | 119.06,51.91 120.33,50.64 | 117.79,84.93 119.06,83.66 | 100.01,98.9 100.01,100.17 | 100.01,100.17 101.28,98.9 | 98.74,98.9 100.01,100.17 | 79.05,98.9 77.78,100.17 | 77.78,100.17 79.05,101.44 | 79.05,101.44 77.78,102.7 | 77.78,97.62 79.05,98.9
GNDA  (via drill 0.61)
  Bottom 0.61: 29.52,11.27 28.25,10 | 29.52,22.06 28.89,21.43 29.52,20.79 | 29.52,31.59 28.25,32.86 29.52,34.12 | 29.52,45.56 28.25,44.28 29.52,43.02 | 29.52,54.45 28.25,55.72 29.52,56.98 | 29.52,65.88 28.25,67.14 29.52,68.42 | 29.52,88.73 28.25,90.01
  Bottom 0.813: 29.52,32.86 28.25,32.86 K6.P2 | 29.52,32.86 29.52,31.59 29.52,22.06 29.52,21.43 | 29.52,21.43 28.89,21.43 K7.P2 | 29.52,21.43 29.52,20.79 29.52,11.27 29.52,10 | 29.52,10 28.25,10 K8.P2 | 29.52,44.28 28.25,44.28 K5.P2 | 29.52,44.28 29.52,43.02 29.52,34.12 29.52,32.86 | K4.P2 28.25,55.72 29.52,55.72 | 29.52,55.72 29.52,54.45 29.52,45.56 29.52,44.28 | 29.52,67.14 28.25,67.14 K3.P2 | 29.52,55.72 29.52,56.98 29.52,65.88 29.52,67.14 | 29.52,78.58 K2.P2 | 29.52,67.14 29.52,68.42 29.52,78.58 | K1.P2 28.25,90.01 29.52,90.01 29.52,88.73 29.52,78.58 | 29.52,10 29.52,6.82 32.06,4.28 v105.09,4.28
N$2
  Bottom 0.813: R5.1 40.32,50.64 T5.2
N$3
  Bottom 0.406: 66.99,60.16 66.35,60.8
  Bottom 0.61: 66.35,60.16 66.99,60.16 IC3.7 | 66.35,60.16 66.35,60.8 | R1.2 52.38,88.73 55.56,85.56 55.56,77.94 58.73,74.77 58.73,72.23 64.45,66.51 | 64.45,66.51 66.35,64.61 66.35,60.16 | 64.45,66.51 63.81,67.14
N$4
  Bottom 0.813: IC3.9 60.64,62.7 56.19,67.14 56.19,74.77 53.65,77.31 R2.2
N$5
  Bottom 0.813: IC3.10 59.37,60.16 53.65,65.88 R3.2
N$6
  Bottom 0.813: IC3.11 58.1,57.62 R4.2
N$7
  Bottom 0.813: R8.2 53.65,23.97 56.19,26.51 56.19,34.76 58.73,37.3 58.73,44.92 61.27,47.46 IC3.15
N$8
  Bottom 0.813: R7.2 53.65,35.4 56.19,37.94 56.19,45.56 60.64,50 IC3.14
N$9
  Bottom 0.813: IC3.13 59.37,52.54 53.65,46.83 R6.2
N$10
  Bottom 0.813: R1.1 40.32,96.36 T9.2
N$11
  Bottom 0.406: IC3.1 72.07,44.92 73.34,45.87 81.91,45.87 84.77,48.73 IC7.16
N$12
  Bottom 0.406: IC3.2 70.16,47.46 70.8,46.83 81.59,46.83 82.23,47.46 IC7.17
N$13
  Bottom 0.406: IC7.18 79.69,49.37 78.42,48.09 72.07,48.09 70.16,50 IC3.3
N$14
  Bottom 0.813: IC3.6 73.97,57.62 77.15,55.08 IC7.19
N$15
  Bottom 0.61: 38.41,45.56 37.14,44.28
  Bottom 0.813: T5.3 38.41,45.56 D6.A 37.14,44.28 K5.16
N$16  (3 unrouted)
  Bottom 0.813: IC1.5 R22.2 107.63,107.15 100.64,107.15 | R21.2 94.93,105.25
N$17
  Bottom 0.813: R2.1 40.32,84.93 T2.2
N$18
  Bottom 0.61: 37.14,90.01 38.41,91.28
  Bottom 0.813: T9.3 38.41,91.28 D1.A 37.14,90.01 K1.16
N$19
  Bottom 0.61: 37.14,78.58 38.41,79.84
  Bottom 0.813: T2.3 38.41,79.84 D9.A 37.14,78.58 K2.16
N$20
  Bottom 0.813: R6.1 40.32,39.2 T6.2
N$21
  Bottom 0.813: R3.1 40.32,73.5 T3.2
N$22
  Bottom 0.61: 37.14,67.14 38.41,68.42
  Bottom 0.813: T3.3 38.41,68.42 D8.A 37.14,67.14 K3.16
N$23
  Bottom 0.61: 38.41,34.12 37.14,32.86
  Bottom 0.813: K6.16 37.14,32.86 D5.A 38.41,34.12 T6.3
N$24
  Bottom 0.813: R4.1 40.32,62.06 T4.2
N$25
  Bottom 0.61: 37.14,55.72 38.41,56.98
  Bottom 0.813: T4.3 38.41,56.98 D7.A 37.14,55.72 K4.16
N$26
  Bottom 0.813: R7.1 40.32,27.78 T7.2
N$27
  Bottom 0.61: 38.41,22.7 37.14,21.43
  Bottom 0.813: T7.3 38.41,22.7 D4.A 37.14,21.43 K7.16
N$28
  Bottom 0.813: R8.1 40.32,16.35 T8.2
N$29
  Bottom 0.61: 38.41,11.27 37.14,10
  Bottom 0.813: T8.3 38.41,11.27 D3.A 37.14,10 K8.16
N$30
  Bottom 0.813: IC3.12 58.1,55.08 R5.2
N$31  (via drill 0.61)
  Bottom 0.813: v118.42,126.2 132.39,126.2 133.66,124.93 133.66,76.03 134.3,75.4 145.73,75.4 | 145.73,75.4 146.36,75.4 | 145.73,75.4 147,75.4 147,74.13 | v147,48.73 147,74.13 | 147,74.13 145.73,75.4
N$32
  Bottom 0.406: IC4.2 103.82,74.77 105.09,76.03 107.63,76.03 110.8,72.86 110.8,58.89 107.63,55.72 107.63,41.11 | 107.63,40.48 107.63,41.11 | 107.63,35.71 107.63,35.4 107.95,35.4 | 107.63,35.71 107.63,39.84 | 107.63,39.84 107.63,40.48 | 107.95,35.4 R15.1 | 107.63,40.48 108.26,40.48 | 108.26,40.48 IC6.2 | 108.26,40.48 107.63,41.11 | 107.63,39.84 108.26,40.48 | 107.95,35.4 107.63,35.71
N$33
  Bottom 0.406: 106.36,69.69 106.36,70.32 | 106.36,70.32 IC4.1 | 106.99,69.69 107.63,69.69 | 105.09,32.86 JP1.11 | 105.09,33.49 105.09,32.86 | 105.09,33.49 105.09,34.76 106.36,36.03 106.36,56.35 109.53,59.53 109.53,69.69 106.99,69.69 | 106.99,69.69 106.36,69.69 | 106.36,69.69 105.72,69.69 | 105.72,69.69 101.91,69.69 98.74,66.51 IC4.17 | 105.09,33.49 105.72,32.86 | 105.72,32.86 106.36,32.22 | 103.82,32.22 105.09,33.49 | 104.45,32.22 105.09,32.86 | 105.09,32.86 105.72,32.86 | 106.36,70.32 105.72,69.69 | 106.99,69.69 106.36,70.32
  Bottom 0.813: JP1.3 JP1.1 | JP1.3 114.61,32.22 | JP1.3 JP1.5 JP1.7 JP1.9 106.36,32.22 JP1.11 104.45,32.22 103.82,32.22 JP1.13 JP1.15
N$35
  Bottom 0.813: X1.1 6.66,96.36 7.93,97.62 K1.S1
N$36
  Bottom 0.813: X1.2 6.66,91.28 7.93,90.01 K1.S2
N$37
  Bottom 0.813: X1.3 6.66,86.2 K2.S1
N$38
  Bottom 0.813: X1.4 14.33,81.06 K2.S2
N$39
  Bottom 0.813: X1.5 6.66,76.03 7.93,74.77 K3.S1
N$40
  Bottom 0.813: X1.6 12.91,71.06 K3.S2
N$41
  Bottom 0.813: X1.7 14.08,66.08 K4.S1
N$42
  Bottom 0.813: X1.8 11.49,61.05 K4.S2
N$43
  Bottom 0.813: X2.1 11.49,46.57 K5.S1
N$44
  Bottom 0.813: X2.2 6.66,41.75 9.2,44.28 K5.S2
N$45
  Bottom 0.813: X2.3 12.91,36.56 K6.S1
N$46
  Bottom 0.813: K6.S2 8.57,32.86 7.3,31.59 6.66,31.59 X2.4
N$47
  Bottom 0.813: X2.5 14.33,26.56 K7.S1
N$48
  Bottom 0.813: X2.6 6.66,21.43 K7.S2
N$49
  Bottom 0.813: X2.7 6.66,16.35 7.93,17.62 K8.S1
N$50
  Bottom 0.813: X2.8 15.3,11.52 K8.S2
N$52
  Bottom 0.61: R23.1 121.6,91.28 121.6,90.64 120.96,90.01
  Bottom 0.813: IC1.12 IC1.11 120.96,103.34 121.6,102.7 121.6,91.28 121.6,90.01 120.96,90.01 R23.1
N$53
  Bottom 0.813: IC4.3 98.74,70.95 82.23,70.95 80.32,69.05 80.32,61.43 81.59,60.16 90.48,60.16 97.47,53.17 IC7.11
N$54  (via drill 0.61)  (2 unrouted)
  Bottom 0.406: IC3.5 IC3.4 73.02,49.05 77.78,49.05 78.42,49.68 78.42,56.98 72.7,62.7 IC3.8
  Bottom 0.61: 96.2,23.33 96.2,22.06 | 96.2,23.33 96.2,38.57 97.47,39.84 97.47,42.38 | 32.06,18.89 33.33,17.62 32.06,16.35 | 32.06,27.78 33.33,29.05 32.06,30.32 | 32.06,39.2 33.33,40.48 32.06,41.75 | 32.06,50.64 33.33,51.91 32.06,53.17 | 32.06,62.06 33.33,63.34 32.06,64.61 | 32.06,73.5 33.33,74.77 32.06,76.03 | 32.06,84.93 33.33,86.2 32.06,87.47 | 32.06,96.36 33.33,97.62 | 93.66,18.89 92.39,20.16 | 95.56,22.06 95.56,22.7 95.88,23.01 | 95.88,23.01 96.2,23.33 | 96.2,23.33 BUS.15 | 119.06,116.68 120.33,117.95 | 126.68,109.69 125.41,110.96 | 131.12,105.88 129.85,107.15 | 132.39,72.86 131.12,74.13 | 97.47,42.38 IC7.10 | 97.47,42.38 98.74,43.65 | 95.88,23.01 95.88,22.7 | BUS.13 95.88,23.01
  Bottom 0.813: 96.52,22.38 96.52,22.7 96.2,22.7 95.88,22.38 95.88,22.7 | 93.66,22.06 BUS.11 92.39,20.79 | 93.66,22.06 BUS.13 95.56,22.06 96.2,22.06 BUS.15 | K1.1 33.33,97.62 32.06,97.62 32.06,96.36 32.06,87.47 32.06,86.2 | 32.06,86.2 33.33,86.2 K2.1 | 32.06,74.77 33.33,74.77 K3.1 | 32.06,74.77 32.06,76.03 32.06,84.93 32.06,86.2 | 32.06,63.34 33.33,63.34 K4.1 | 32.06,63.34 32.06,64.61 32.06,73.5 32.06,74.77 | 32.06,51.91 33.33,51.91 K5.1 | 32.06,51.91 32.06,53.17 32.06,62.06 32.06,63.34 | 32.06,40.48 33.33,40.48 K6.1 | 32.06,51.91 32.06,50.64 32.06,41.75 32.06,40.48 | 32.06,29.05 33.33,29.05 K7.1 | 32.06,40.48 32.06,39.2 32.06,30.32 32.06,29.05 | 32.06,17.62 33.33,17.62 K8.1 | 32.06,29.05 32.06,27.78 32.06,18.89 32.06,17.62 | 98.74,43.65 IC7.10 101.28,43.65 | 92.39,20.79 92.39,20.16 92.39,18.89 93.66,18.89 96.83,18.89 | 101.28,43.65 101.91,43.02 IC6.12 | 118.42,116.04 117.15,114.77 117.15,112.23 118.42,110.96 IC1.14 125.41,110.96 | 32.06,17.62 32.06,16.35 32.06,8.09 33.33,6.82 55.56,6.82 | 55.56,6.82 82.86,6.82 | 82.86,6.82 83.5,6.82 | 125.41,110.96 126.68,110.96 126.68,109.69 126.68,108.42 | 125.41,110.96 124.14,110.96 | 126.68,108.42 7905..1 127.95,107.15 | 119.06,116.68 119.06,117.95 120.33,117.95 IC8.2 | 82.86,6.82 100.01,6.82 | 100.01,6.82 101.28,6.82 | 101.28,6.82 102.55,6.82 | 102.55,6.82 v105.09,6.82 138.11,6.82 144.46,13.81 144.46,71.59 | 143.19,72.86 144.46,72.86 144.46,71.59 | 143.19,72.86 132.39,72.86 131.12,72.86 131.12,74.13 131.12,105.88 131.12,107.15 129.85,107.15 127.95,107.15 | 98.1,18.89 98.1,17.62 | 98.1,17.62 R9.1 | 98.1,18.89 96.83,18.89 | 101.28,6.82 101.28,8.09 | 101.28,8.09 101.28,17.62
  Bottom 0.813: 101.28,17.62 101.28,18.89 100.01,18.89 | 100.01,18.89 99.37,18.89 | 99.37,18.89 98.1,18.89 | 101.28,8.09 102.55,6.82 | 100.01,6.82 101.28,8.09 | 98.1,17.62 96.83,18.89 | 99.37,18.89 98.1,17.62 | 101.28,17.62 100.01,18.89 | 92.39,20.79 93.66,22.06 | 127.95,107.15 126.68,108.42 | 144.46,71.59 143.19,72.86 | IC4.19 103.82,60.8 100.64,57.62 100.64,44.28 101.28,43.65 | 74.61,38.57 74.61,34.76 70.16,27.78 70.16,21.43 55.56,6.82 | 74.61,38.57 74.61,39.84 | 74.61,39.84 74.61,41.11 | 74.61,41.11 IC7.1 | 74.61,39.84 73.34,39.84 | 73.34,39.84 69.53,39.84 66.35,43.02 66.35,51.91 66.99,52.54 IC3.4 IC3.5 | 74.61,38.57 73.34,39.84 | 73.34,39.84 74.61,41.11 | IC4.10 80.32,73.5 IC3.8
N$55
  Bottom 0.254: 19.33,105.71 19.33,107.44
N$56
  Bottom 0.61: 126.68,60.16 127.95,61.43 126.68,62.7 | 129.85,61.43 131.12,60.16
  Bottom 0.813: 126.68,60.16 126.68,62.7 D10.A | R14.1 131.12,60.16 131.12,61.43 129.85,61.43 127.95,61.43 126.68,61.43 126.68,60.16 | 126.68,60.16 126.68,57.62 IC5.2
N$57
  Bottom 0.813: C1.2 63.81,103.34 65.72,105.25 67.62,105.25 | 67.62,105.25 R17.2 68.89,104.61 | 68.89,104.61 68.89,84.29 69.53,83.66 U$1.10 73.34,83.66 75.88,86.2 75.88,96.99 73.97,98.9 R18.1 | 68.89,104.61 67.62,105.25
N$58
  Bottom 0.61: IC5.1 128.58,55.08 129.22,54.45 131.76,54.45 D12.A
  Bottom 0.813: D12.A 135.57,56.98 | 135.57,56.98 136.84,56.98 136.84,58.25 | 136.84,58.25 D10.C | 135.57,56.98 136.84,58.25
N$59
  Bottom 0.61: 24.44,18.25 25.08,17.62 | 24.44,30.32 25.71,29.05 24.44,27.78 | 24.44,39.2 25.71,40.48 24.44,41.75 | 24.44,50.64 25.71,51.91 24.44,53.17 | 24.44,64.61 25.71,63.34 24.44,62.06 | 24.44,73.5 25.71,74.77 24.44,76.03 | 24.44,96.36 25.71,97.62
  Bottom 0.813: 24.44,63.34 24.44,64.61 24.44,73.5 24.44,74.77 | 24.44,51.91 24.44,53.17 24.44,62.06 24.44,63.34 | 24.44,51.91 24.44,50.64 24.44,41.75 24.44,40.48 | 24.44,40.48 24.44,39.2 24.44,30.32 24.44,29.05 | 24.44,29.05 24.44,27.78 24.44,18.25 24.44,17.62 25.08,17.62 K8.P1 | 24.44,74.77 24.44,76.03 24.44,86.2 | 24.44,86.2 24.44,96.36 24.44,97.62 25.71,97.62 K1.P1 26.98,99.53 33.33,105.88 R16.1 | 24.44,86.2 K2.P1 | 24.44,74.77 25.71,74.77 K3.P1 | 24.44,40.48 25.71,40.48 K6.P1 | 24.44,29.05 25.71,29.05 K7.P1 | K5.P1 25.71,51.91 24.44,51.91 | 24.44,63.34 25.71,63.34 K4.P1
N$60
  Bottom 0.813: C3.1 62.54,95.09 U$1.1
N$61
  Bottom 0.254: 20.2,110.26 22.48,113.66
N$62
  Bottom 0.813: C2.1 U$1.2
N$63
  Bottom 0.61: 122.23,44.28 123.5,45.56 | 117.15,45.56 118.42,44.28 117.15,43.02
  Bottom 0.813: R13.1 117.15,45.56 R12.2 | R13.1 118.42,44.28 122.23,44.28 123.5,44.28 123.5,45.56 IC5.6 | R13.1 117.15,43.02 117.15,39.2 D13.A
N$64
  Bottom 0.61: 126.68,39.2 125.41,40.48 124.14,39.2 | 120.96,37.3 122.23,38.57 123.5,37.3
  Bottom 0.813: IC6.4 113.34,45.56 115.25,43.65 115.25,38.57 116.52,37.3 120.96,37.3 122.23,37.3 | 122.23,37.3 123.5,37.3 124.14,37.3 D11.A | 125.41,39.2 126.68,39.2 D13.C | 125.41,39.2 125.41,40.48 125.41,46.19 126.04,46.19 IC5.7 | 125.41,39.2 124.14,39.2 122.23,39.2 122.23,38.57 122.23,37.3
N$65
  Bottom 0.813: R18.2 C6.2 C8.2 R19.1
N$66  (via drill 0.61)  (1 unrouted)
  Bottom 0.406: R24.2 110.17,79.21 C12.2
  Bottom 0.813: U$2.10 88.58,84.29 103.18,84.29 103.82,83.66 110.17,83.66 C12.2 | R24.2 115.25,76.67 v115.25,63.97 115.25,60.8 R12.1 | IC5.3 v123.5,63.97
N$67
  Bottom 0.813: 58.73,104.61 C1.1 58.73,89.37 61.91,86.2 U$1.4 | 58.73,104.61 R17.1 57.46,105.88 | 57.46,105.88 R16.2 | 58.73,104.61 57.46,105.88
N$68  (1 unrouted)
N$69
  Bottom 0.61: R20.2 83.5,109.06 C8.1
  Bottom 0.813: C7.1 R21.1 84.77,107.79 | 84.77,107.79 R20.2 | 84.77,107.79 83.5,109.06
N$70
  Bottom 0.813: U$2.1 97.47,90.01 C14.1
N$71  (3 unrouted)
  Bottom 0.813: IC1.4 110.8,109.06
N$73
  Bottom 0.813: U$2.2 C13.1
N$74
  Bottom 0.813: R24.1 C12.1 R23.2 100.01,94.45 92.39,94.45 89.85,91.91 U$2.4
N$128
  Bottom 0.254: 19.73,110.61 22.03,114.06
N$130
  Bottom 0.254: 18.2,110.61 15.93,114.09
N$138
  Bottom 0.61: 21.62,114.04 19.61,110.94 19,111.15 21.21,114.3 20.1,114.76 18.42,114.98 17.27,114.7 16.28,114.04 18.36,111.02 18.73,111.05 20.54,114.28 18.35,114.59 16.77,113.82 18.63,111.22 19.82,114.3 17.16,113.62 18.52,111.89 19.22,114.08 17.64,113.41 18.46,112.62 18.53,113.56 18.38,114.64
N$147
  Bottom 0.61: 22.55,113.18 23.38,111.45 23.42,110.11 23.13,108.83 22.7,107.97 21.83,107.13 20.8,106.37 19.56,106.03 19.71,107.23 20.74,108.07 20.94,109.23 20.83,109.73 20.57,110.28 22.29,112.8 22.74,112.03 22.41,112 21.02,109.98 21.24,109.52 22.94,111.8 22.92,108.8 20.78,106.58 19.84,106.72 20.51,107.48 20.68,106.92 21.09,107.84 21.79,107.98 21.11,108.45 22.22,108.41 21.17,109.1 22.62,108.79 21.52,109.5 22.74,109.37 21.95,109.89 22.61,110.13 22.42,110.75
PB0
  Bottom 0.813: BUS.2 79.69,34.76 77.15,37.94 IC7.2
PB1
  Bottom 0.813: BUS.4 82.23,34.76 79.69,37.94 IC7.3
PB2
  Bottom 0.813: BUS.6 84.77,34.76 82.23,37.94 IC7.4
PB3
  Bottom 0.813: BUS.8 87.31,34.76 84.77,37.94 IC7.5
PB4
  Bottom 0.813: BUS.10 89.85,34.76 87.31,37.94 IC7.6
PB5
  Bottom 0.813: BUS.12 92.39,34.76 89.85,37.94 IC7.7
PB6
  Bottom 0.813: BUS.14 94.93,34.76 92.39,37.94 IC7.8
PB7
  Bottom 0.406: BUS.16 97.47,33.49 98.74,34.76 103.18,34.76 105.41,36.98 105.41,57.94 107.63,60.16 107.63,67.78 106.67,68.73 102.55,68.73 101.28,67.46 IC4.18
TREF
  Bottom 0.813: R9.2 119.06,16.35 TR1.1 X3.1
V0
  Bottom 0.61: 131.12,45.56 129.85,44.28 131.12,43.02
  Bottom 0.813: R14.2 131.76,46.83 | 131.12,44.28 129.85,44.28 R13.2 | 131.12,44.28 131.12,45.56 | 131.12,45.56 R14.2 | 131.12,44.28 131.12,43.02 131.12,41.11 D11.C X3.2 | R14.2 132.39,46.83 | 132.39,46.83 D12.C | 131.12,45.56 132.39,46.83
(copper drawn outside any net)
  Bottom 0.254: 19.33,107.44 arc125 20.1,110.34 | 18.1,110.54 arc-58 19.75,110.59 | 19.3,105.73 arc128 22.48,113.69 | 15.83,114.06 arc-82 22.05,114.06
  shapes: Bottom circle x10

### Text on the board
Bottom: Amplificador G1000 - Abril 2006 | LMPT | +
Dimension: + | + | + | + | +